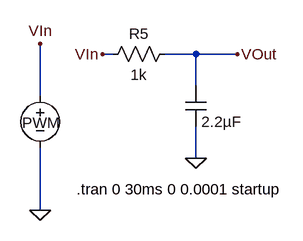
[diagram p0: schematic lopass1.asc]
lopass1.asc, the LTspice schematic file:
Version 4
SHEET 1 1316 680
WIRE -592 -16 -608 -16
WIRE -464 -16 -512 -16
WIRE -400 -16 -464 -16
WIRE -464 32 -464 -16
WIRE -704 48 -704 -32
WIRE -464 144 -464 96
WIRE -704 224 -704 128
FLAG -704 -32 VIn
FLAG -400 -16 VOut
FLAG -704 224 0
FLAG -608 -16 VIn
FLAG -464 144 0
SYMBOL voltage -704 32 R0
WINDOW 0 -28 58 Left 2
WINDOW 3 24 96 Invisible 2
WINDOW 123 0 0 Left 2
WINDOW 39 0 0 Left 2
SYMATTR InstName PWM
SYMATTR Value PULSE(0 5 0 0.01ms 0.01ms 1.020ms 2.040ms)
SYMBOL res -496 -32 R90
WINDOW 0 0 56 VBottom 2
WINDOW 3 32 56 VTop 2
SYMATTR InstName R5
SYMATTR Value 1k
SYMBOL cap -480 32 R0
WINDOW 0 24 8 Invisible 2
SYMATTR InstName C5
SYMATTR Value 2.2µF
TEXT -648 192 Left 2 !.tran 0 30ms 0 0.0001 startup

The netlist it stands for:
* lopass1.asc
V§PWM VIn 0 PULSE(0 5 0 0.01ms 0.01ms 1.020ms 2.040ms)
R5 VOut VIn 1k
C5 VOut 0 2.2µF
.tran 0 30ms 0 0.0001 startup
.backanno
.end